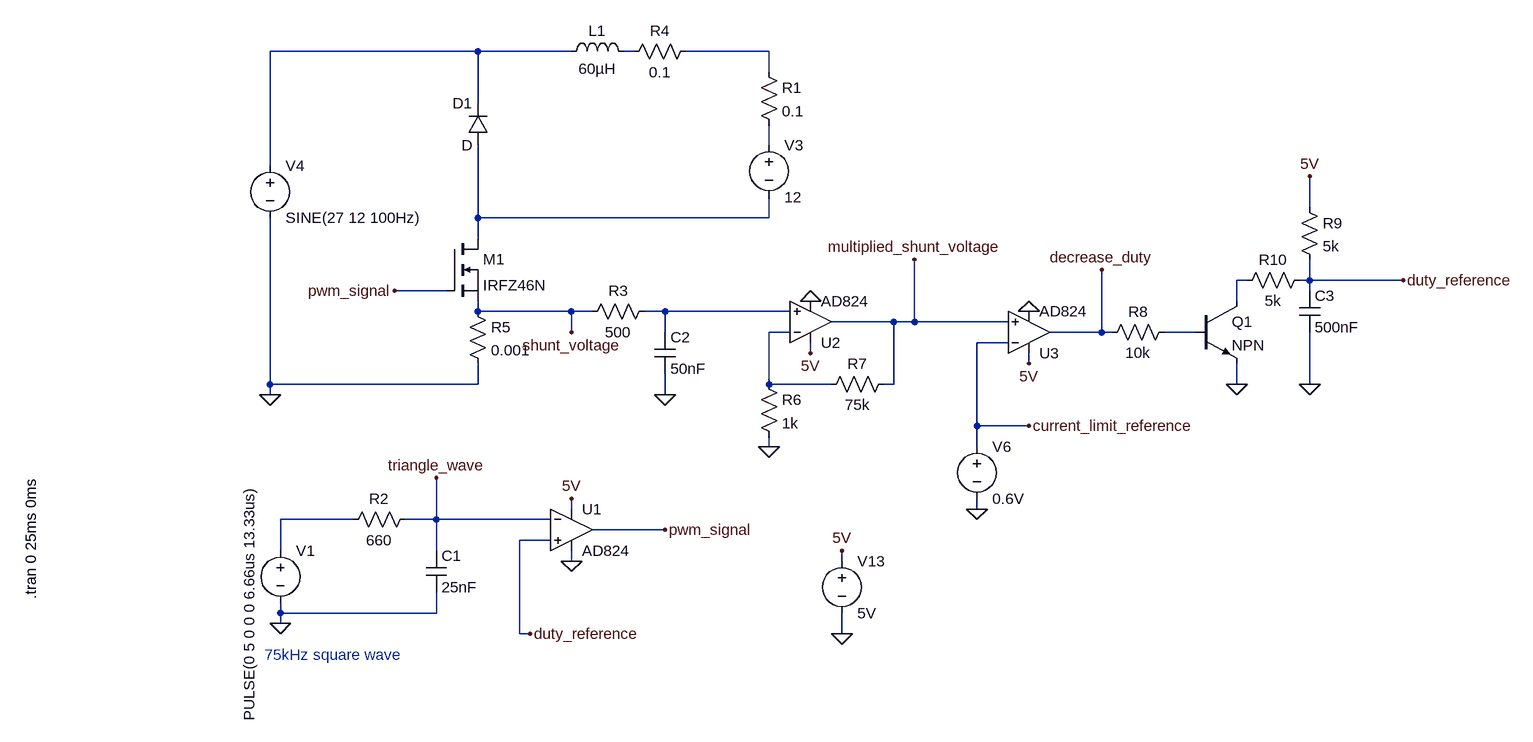
[diagram p0: schematic buck converter pwm_method.asc]
buck converter pwm_method.asc, the LTspice schematic file:
Version 4
SHEET 1 1984 1156
WIRE 368 -80 48 -80
WIRE 512 -80 368 -80
WIRE 608 -80 592 -80
WIRE 816 -80 688 -80
WIRE 816 -48 816 -80
WIRE 368 0 368 -80
WIRE 816 64 816 32
WIRE 48 96 48 -80
WIRE 1648 160 1648 112
WIRE 368 176 368 64
WIRE 816 176 816 144
WIRE 816 176 368 176
WIRE 368 208 368 176
WIRE 1552 272 1536 272
WIRE 1648 272 1648 240
WIRE 1648 272 1632 272
WIRE 1792 272 1648 272
WIRE 320 288 240 288
WIRE 1648 288 1648 272
WIRE 1536 304 1536 272
WIRE 368 320 368 304
WIRE 512 320 368 320
WIRE 544 320 512 320
WIRE 656 320 624 320
WIRE 848 320 656 320
WIRE 1008 336 912 336
WIRE 1040 336 1040 240
WIRE 1040 336 1008 336
WIRE 1184 336 1040 336
WIRE 512 352 512 320
WIRE 656 352 656 320
WIRE 848 352 816 352
WIRE 1328 352 1328 256
WIRE 1328 352 1248 352
WIRE 1344 352 1328 352
WIRE 1472 352 1424 352
WIRE 1184 368 1136 368
WIRE 880 384 880 368
WIRE 1216 400 1216 384
WIRE 48 432 48 176
WIRE 368 432 368 400
WIRE 368 432 48 432
WIRE 816 432 816 352
WIRE 912 432 816 432
WIRE 1008 432 1008 336
WIRE 1008 432 992 432
WIRE 1536 432 1536 400
WIRE 1648 432 1648 352
WIRE 48 448 48 432
WIRE 656 448 656 416
WIRE 1136 496 1136 368
WIRE 1216 496 1136 496
WIRE 816 528 816 512
WIRE 1136 528 1136 496
WIRE 512 624 512 608
WIRE 1136 624 1136 608
WIRE 176 640 64 640
WIRE 304 640 304 576
WIRE 304 640 256 640
WIRE 480 640 304 640
WIRE 656 656 544 656
WIRE 480 672 432 672
WIRE 64 688 64 640
WIRE 304 688 304 640
WIRE 512 704 512 688
WIRE 928 704 928 688
WIRE 64 784 64 768
WIRE 304 784 304 752
WIRE 304 784 64 784
WIRE 64 800 64 784
WIRE 432 816 432 672
WIRE 448 816 432 816
WIRE 928 816 928 784
FLAG 928 816 0
FLAG 928 688 5V
FLAG 64 800 0
FLAG 512 704 0
FLAG 512 608 5V
FLAG 48 448 0
FLAG 656 448 0
FLAG 880 304 0
FLAG 880 384 5V
FLAG 816 528 0
FLAG 1216 320 0
FLAG 1216 400 5V
FLAG 1136 624 0
FLAG 1536 432 0
FLAG 1648 432 0
FLAG 1648 112 5V
FLAG 1328 256 decrease_duty
FLAG 1792 272 duty_reference
FLAG 448 816 duty_reference
FLAG 656 656 pwm_signal
FLAG 240 288 pwm_signal
FLAG 1216 496 current_limit_reference
FLAG 512 352 shunt_voltage
FLAG 1040 240 multiplied_shunt_voltage
FLAG 304 576 triangle_wave
SYMBOL nmos 320 208 R0
SYMATTR InstName M1
SYMATTR Value IRFZ46N
SYMBOL diode 384 64 R180
WINDOW 0 24 64 Left 2
WINDOW 3 24 0 Left 2
SYMATTR InstName D1
SYMBOL ind 496 -64 R270
WINDOW 0 32 56 VTop 2
WINDOW 3 5 56 VBottom 2
SYMATTR InstName L1
SYMATTR Value 60µH
SYMBOL voltage 816 48 R0
WINDOW 123 0 0 Left 0
WINDOW 39 0 0 Left 0
SYMATTR InstName V3
SYMATTR Value 12
SYMBOL res 800 -64 R0
SYMATTR InstName R1
SYMATTR Value 0.1
SYMBOL res 704 -96 R90
WINDOW 0 0 56 VBottom 2
WINDOW 3 32 56 VTop 2
SYMATTR InstName R4
SYMATTR Value 0.1
SYMBOL res 352 304 R0
SYMATTR InstName R5
SYMATTR Value 0.001
SYMBOL voltage 928 688 R0
WINDOW 123 0 0 Left 0
WINDOW 39 0 0 Left 0
SYMATTR InstName V13
SYMATTR Value 5V
SYMBOL voltage 64 672 R0
WINDOW 3 -48 -83 VRight 2
WINDOW 123 0 0 Left 0
WINDOW 39 0 0 Left 0
SYMATTR Value PULSE(0 5 0 0 0 6.66us 13.33us)
SYMATTR InstName V1
SYMBOL res 272 624 R90
WINDOW 0 0 56 VBottom 2
WINDOW 3 32 56 VTop 2
SYMATTR InstName R2
SYMATTR Value 660
SYMBOL cap 288 688 R0
SYMATTR InstName C1
SYMATTR Value 25nF
SYMBOL OpAmps\\AD824 512 592 R0
SYMATTR InstName U1
SYMBOL voltage 48 80 R0
WINDOW 123 0 0 Left 0
WINDOW 39 0 0 Left 0
SYMATTR InstName V4
SYMATTR Value SINE(27 12 100Hz)
SYMBOL res 640 304 R90
WINDOW 0 0 56 VBottom 2
WINDOW 3 32 56 VTop 2
SYMATTR InstName R3
SYMATTR Value 500
SYMBOL cap 640 352 R0
SYMATTR InstName C2
SYMATTR Value 50nF
SYMBOL OpAmps\\AD824 880 400 M180
SYMATTR InstName U2
SYMBOL res 800 416 R0
SYMATTR InstName R6
SYMATTR Value 1k
SYMBOL res 1008 416 R90
WINDOW 0 0 56 VBottom 2
WINDOW 3 32 56 VTop 2
SYMATTR InstName R7
SYMATTR Value 75k
SYMBOL OpAmps\\AD824 1216 416 M180
SYMATTR InstName U3
SYMBOL voltage 1136 512 R0
WINDOW 123 0 0 Left 0
WINDOW 39 0 0 Left 0
SYMATTR InstName V6
SYMATTR Value 0.6V
SYMBOL npn 1472 304 R0
SYMATTR InstName Q1
SYMBOL cap 1632 288 R0
SYMATTR InstName C3
SYMATTR Value 500nF
SYMBOL res 1632 144 R0
SYMATTR InstName R9
SYMATTR Value 5k
SYMBOL res 1440 336 R90
WINDOW 0 0 56 VBottom 2
WINDOW 3 32 56 VTop 2
SYMATTR InstName R8
SYMATTR Value 10k
SYMBOL res 1648 256 R90
WINDOW 0 0 56 VBottom 2
WINDOW 3 32 56 VTop 2
SYMATTR InstName R10
SYMATTR Value 5k
TEXT 40 848 Left 2 ;75kHz square wave
TEXT -320 576 VRight 2 !.tran 0 25ms 0ms

The netlist it stands for:
* buck converter pwm_method.asc
M1 N005 pwm_signal shunt_voltage shunt_voltage IRFZ46N
D1 N005 N001 D
L1 N001 N002 60µH
V3 N004 N005 12
R1 N003 N004 0.1
R4 N003 N002 0.1
R5 shunt_voltage 0 0.001
V13 5V 0 5V
V1 N010 0 PULSE(0 5 0 0 0 6.66us 13.33us)
R2 triangle_wave N010 660
C1 triangle_wave 0 25nF
XU1 duty_reference triangle_wave 5V 0 pwm_signal AD824  ; pins In+ In- V+ V- OUT
V4 N001 0 SINE(27 12 100Hz)
R3 N007 shunt_voltage 500
C2 N007 0 50nF
XU2 N007 N008 5V 0 multiplied_shunt_voltage AD824  ; pins In+ In- V+ V- OUT
R6 N008 0 1k
R7 multiplied_shunt_voltage N008 75k
XU3 multiplied_shunt_voltage current_limit_reference 5V 0 decrease_duty AD824  ; pins In+ In- V+ V- OUT
V6 current_limit_reference 0 0.6V
Q1 N006 N009 0 0 NPN
C3 duty_reference 0 500nF
R9 5V duty_reference 5k
R8 N009 decrease_duty 10k
R10 duty_reference N006 5k
.model D D
.lib standard.dio
.model NPN NPN
.model PNP PNP
.lib standard.bjt
.model NMOS NMOS
.model PMOS PMOS
.lib standard.mos
* 75kHz square wave
.tran 0 25ms 0ms
.backanno
.end